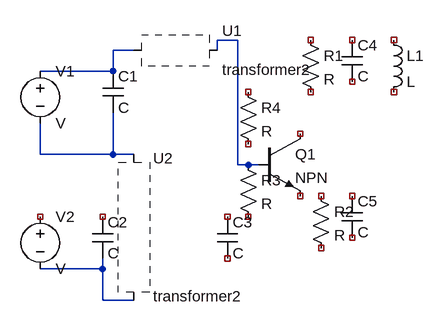
[diagram p0: schematic BJT.asc]
BJT.asc, the LTspice schematic file:
Version 4
SHEET 1 880 680
WIRE 576 96 544 96
WIRE 416 112 384 112
WIRE 544 112 544 96
WIRE 384 144 384 112
WIRE 384 144 272 144
WIRE 272 272 272 224
WIRE 384 272 384 208
WIRE 384 272 272 272
WIRE 416 272 384 272
WIRE 576 288 576 96
WIRE 592 288 576 288
WIRE 608 288 592 288
WIRE 368 448 368 432
WIRE 368 448 272 448
WIRE 368 496 368 448
WIRE 416 496 368 496
SYMBOL voltage 272 128 R0
SYMATTR InstName V1
SYMBOL voltage 272 352 R0
SYMATTR InstName V2
SYMBOL cap 368 144 R0
SYMATTR InstName C1
SYMBOL cap 352 368 R0
SYMATTR InstName C2
SYMBOL npn 608 240 R0
SYMATTR InstName Q1
SYMBOL Magnetic/transformer2 400 112 R0
SYMATTR InstName U1
SYMBOL Magnetic/transformer2 400 336 R0
SYMATTR InstName U2
SYMBOL res 672 80 R0
SYMATTR InstName R1
SYMBOL res 688 320 R0
SYMATTR InstName R2
SYMBOL res 576 272 R0
SYMATTR InstName R3
SYMBOL res 576 160 R0
SYMATTR InstName R4
SYMBOL cap 544 368 R0
SYMATTR InstName C3
SYMBOL cap 736 96 R0
SYMATTR InstName C4
SYMBOL cap 736 336 R0
SYMATTR InstName C5
SYMBOL ind 800 80 R0
SYMATTR InstName L1

The netlist it stands for:
* BJT.asc
V1 N002 N003 V
V2 NC_01 N004 V
C1 N002 N003 C
C2 NC_02 N004 C
Q1 NC_03 N001 NC_04 0 NPN
* U1: transformer2 (symbol Magnetic/transformer2 not available, pin order unknown); nets seen at it: N001, N002
* U2: transformer2 (symbol Magnetic/transformer2 not available, pin order unknown); nets seen at it: N003, N004
R1 NC_05 NC_06 R
R2 NC_07 NC_08 R
R3 N001 NC_09 R
R4 NC_10 NC_11 R
C3 NC_12 NC_13 C
C4 NC_14 NC_15 C
C5 NC_16 NC_17 C
L1 NC_18 NC_19 L
.model NPN NPN
.model PNP PNP
.lib standard.bjt
.backanno
.end